# Altium schematic sheet power.SchDoc
size A4
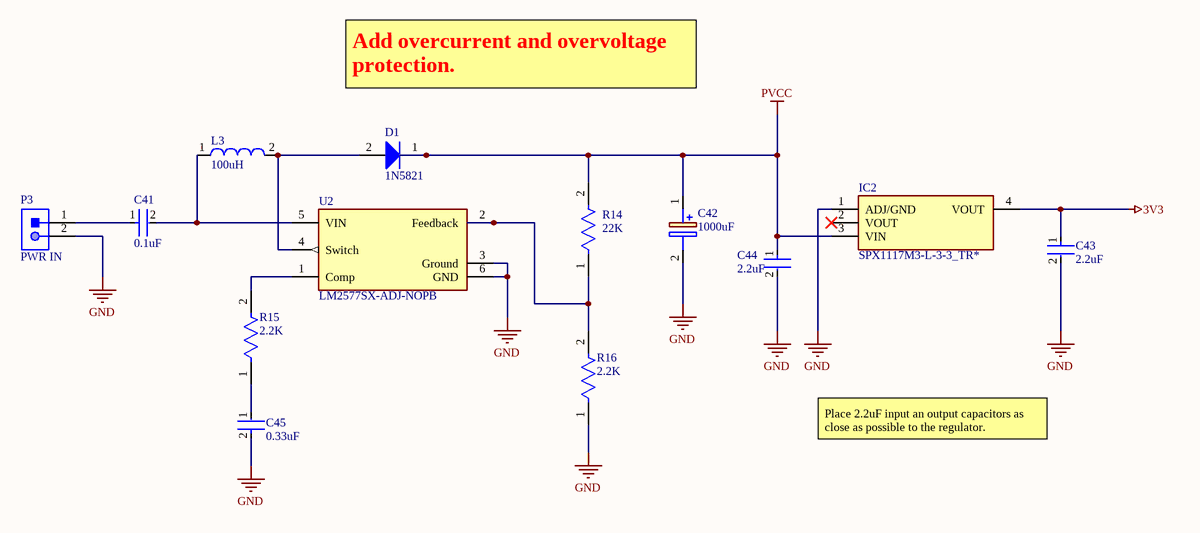
[diagram p0: power.SchDoc]

## Parts
C41  0.1uF  [TDK_C2012-125-0_2_IPC_A]
C42  1000uF  [CAPPRD500W60D1275H2700]
C43  2.2uF  [Samsung_CL21_IPC_A]
C44  2.2uF  [Samsung_CL21_IPC_A]
C45  0.33uF  [TDK_C1608-080-0_1_IPC_B]
D1  1N5821  [ONSC-AXIAL_LEAD-2-267-05_V]
IC2  SPX1117M3-L-3-3_TR*  [SOT230P700X180-4N]
L3  100uH  [WE-PD-XXL]
P3  PWR IN  [PHOE-1803277_V]
R14  22K  [TE_Connectivity_CRGCQ2512_IPC_A]
R15  2.2K  [KOA_Speer_RK73H2E_IPC_A]
R16  2.2K  [KOA_Speer_RK73H2E_IPC_A]
U2  LM2577SX-ADJ-NOPB  [Texas_Instruments_KTT0005B_MFG]

## Nets
3V3: C43.1 IC2.4(VOUT)
GND: C42.2(-) C43.2 C44.2 C45.2 IC2.1(ADJ/GND) P3.2 R16.1 U2.3(Ground) U2.6(GND)
PVCC: C42.1(+) C44.1 D1.1(K) IC2.3(VIN) R14.2
NetC41_1: C41.1 P3.1
NetC41_2: C41.2 L3.1 U2.5(VIN)
NetC45_1: C45.1 R15.1
NetD1_2: D1.2(A) L3.2 U2.4(Switch)
NetR14_1: R14.1 R16.2 U2.2(Feedback)
NetR15_2: R15.2 U2.1(Comp)

Not connected (* = marked no-connect by the designer): IC2 2(VOUT)*

## Notes on the sheet
- Add overcurrent and overvoltage protection.
- Place 2.2uF input an output capacitors as close as possible to the regulator.

## Library data of the parts
C41 = C2012X7R2A104K125AA: C Series 0805 0.1 uF 100 V ±10 % Tolerance X7R SMT Multilayer Ceramic Capacitor; Manufacturer: TDK; Capacitance: 100nF; Tolerance: 10%; Voltage Rating: 100V; Supplier 1: Digi-Key; Manufacturer Part Number: C2012X7R2A104K; RoHS: Yes; Category: Ceramic Capacitors; Stock 1: 559939; Pricing 1: 1=0.19000, 10=0.12900, 50=0.07760, 100=0.06560, 500=0.04484, 1000=0.03968 (USD); Mount: Surface Mount; Case/Package: 0805; Number of Pins: 2; Case Code (Imperial): 0805; Case Code (Metric): 2012; Min Operating Temperature: -55°C; Max Operating Temperature: 125°C; Packaging: Tape and Reel; Package Quantity: 2000; Dielectric: X7R; Termination: SMD/SMT; Construction: Flat; Length: 2mm; Depth: 1.25mm; Radiation Hardening: No; REACH SVHC: No SVHC; ComponentLink1URL: https://datasheet.ciiva.com/3777/351print-detail-pdf-phplangenpart-noc2012x7r2a104k125aaimp-unit-xmhz-3777221.pdf?src-supplier=Arrow+Electronics; ComponentLink1Description: https://datasheet.ciiva.com/3777/351print-detail-pdf-phplangenpart-noc2012x7r2a104k125aaimp-unit-xmhz-3777221.pdf?src-supplier=Arrow+Electronics; ComponentLink2URL: https://datasheet.ciiva.com/15192/getdatasheetpartid-149415-15192179.pdf?src-supplier=Verical; ComponentLink2Description: https://datasheet.ciiva.com/15192/getdatasheetpartid-149415-15192179.pdf?src-supplier=Verical; ComponentLink3URL: https://datasheet.ciiva.com/15918/517print-detail-pdf-phplangenpart-noc2012x7r2a104k125aaimp-unit-xmhz-15918629.pdf?src-supplier=Onlinecomponents.com; ComponentLink3Description: https://datasheet.ciiva.com/15918/517print-detail-pdf-phplangenpart-noc2012x7r2a104k125aaimp-unit-xmhz-15918629.pdf?src-supplier=Onlinecomponents.com; Supplier Part Number 1: 445-1418-1-ND
C42 = UVR1H102MHD1TO: CAP ALUM 1000UF 20% 50V RADIAL; Manufacturer_Name: Nichicon; Manufacturer: Kyocera AVX; Capacitance: 1mF; Life (Hours): 2000Hour; Polarity: Polar; Datasheet Link: http://nichicon-us.com/english/products/pdfs/e-uvr.pdf; Height: 27mm; Manufacturer_Part_Number: UVR1H102MHD1TO; Mouser Part Number: 647-UVR1H102MHD1T0; Mouser Price/Stock: https://www.mouser.co.uk/ProductDetail/Nichicon/UVR1H102MHD1TO?qs=Wu4QelNNmeNg4t%252BBksLOmQ%3D%3D; Arrow Part Number: UVR1H102MHD1TO; Arrow Price/Stock: https://www.arrow.com/en/products/uvr1h102mhd1to/nichicon; Supplier 1: Digi-Key; Manufacturer Part Number: UVR1H102MHD; RoHS: Yes; Stock 1: 1657; Pricing 1: 1=1.07000, 10=0.81600, 50=0.67820, 100=0.58390, 500=0.45208, 1000=0.38930, 2500=0.36418, 5000=0.34534 (USD); Mount: Through Hole,PCB; Case/Package: Radial; Min Operating Temperature: -40°C; Max Operating Temperature: 85°C; Tolerance: 20%; Voltage Rating (DC): 50V; Packaging: Bulk; Voltage Rating: 50V; Lead Pitch: 0.197inch; Height - Seated (Max): 1.063inch; ComponentLink1URL: http://nichicon-us.com/english/products/pdfs/e-mi_tape.pdf?src-supplier=Digi-Key; ComponentLink1Description: http://nichicon-us.com/english/products/pdfs/e-mi_tape.pdf?src-supplier=Digi-Key; Supplier Part Number 1: 493-1111-ND
C43 C44 = CL21B225KAFNFNE: CAP CER 2.2UF 25V X7R 0805; Manufacturer: Samsung; Tolerance: 10%; Supplier 1: Digi-Key; Manufacturer Part Number: CL21B225KAFNFNE; RoHS: Yes; Category: Ceramic Capacitors; Stock 1: 369523; Pricing 1: 1=0.22000, 10=0.15700, 50=0.08920, 100=0.07390, 500=0.05180, 1000=0.04289 (USD); Mount: Surface Mount; Case/Package: 0805; Case Code (Metric): 2012; Case Code (Imperial): 0805; Min Operating Temperature: -55°C; Max Operating Temperature: 125°C; Package Quantity: 1; Packaging: Tape and Reel; Capacitance: 2.2uF; Voltage Rating: 25V; Dielectric: X7R; Series: CL; Construction: Flat; Length: 0.079inch; Width: 0.049inch; Height: 1.25mm; Thickness: 0.053inch; Depth: 1.25mm; Radiation Hardening: No; Lead Free: Lead Free; RoHS Compliant: Yes; ComponentLink1URL: https://datasheet.ciiva.com/25798/cl21b225kafnfne-25798721.pdf?src-supplier=Digi-Key; ComponentLink1Description: https://datasheet.ciiva.com/25798/cl21b225kafnfne-25798721.pdf?src-supplier=Digi-Key; Supplier Part Number 1: 1276-2953-1-ND
C45 = C1608X7R1H334K080AC: Cap Ceramic 0.33uF 50V X7R 10% Pad SMD 0603 125°C Low ESR T/R; Manufacturer: TDK; Capacitance: 330nF; Supplier 1: Digi-Key; Manufacturer Part Number: C1608X7R1H334K080AC; RoHS: Yes; Category: Ceramic Capacitors; Stock 1: 247635; Pricing 1: 1=0.25000, 10=0.17200, 50=0.11500, 100=0.09780, 500=0.06900, 1000=0.06038 (USD); Mount: Surface Mount; Case/Package: 0603; Case Code (Metric): 1608; Case Code (Imperial): 0603; Dielectric Material: Ceramic; Weight: 7.1E-05oz; Min Operating Temperature: -55°C; Max Operating Temperature: 125°C; Tolerance: 10%; Voltage Rating: 50V; Packaging: Tape and Reel; Voltage Rating (DC): 50V; Dielectric: X7R; Termination: SMD/SMT; Construction: Flat; Package Quantity: 1; Resistor Type: Ceramic; Voltage: 50V; Series: C; Length: 1.6mm; Width: 0.031inch; Height: 0.8mm; Depth: 0.8mm; Thickness: 0.037inch; Lead Free: Lead Free; RoHS Compliant: Yes; REACH SVHC: No SVHC; ComponentLink1URL: https://datasheet.ciiva.com/6290/tdkmlcccaprange-6290782.pdf?src-supplier=Digi-Key; ComponentLink1Description: https://datasheet.ciiva.com/6290/tdkmlcccaprange-6290782.pdf?src-supplier=Digi-Key; ComponentLink2URL: https://datasheet.ciiva.com/6290/tdkmlcccaprange-6290791.pdf?src-supplier=Digi-Key; ComponentLink2Description: https://datasheet.ciiva.com/6290/tdkmlcccaprange-6290791.pdf?src-supplier=Digi-Key; ComponentLink3URL: https://datasheet.ciiva.com/22718/1796654-22718021.pdf?src-supplier=Element14; ComponentLink3Description: https://datasheet.ciiva.com/22718/1796654-22718021.pdf?src-supplier=Element14; ComponentLink4URL: https://datasheet.ciiva.com/16427/general-b11-16427753.pdf?src-supplier=Future+Electronics; ComponentLink4Description: https://datasheet.ciiva.com/16427/general-b11-16427753.pdf?src-supplier=Future+Electronics; ComponentLink5URL: https://datasheet.ciiva.com/23803/1735394-23803004.pdf?src-supplier=Newark; ComponentLink5Description: https://datasheet.ciiva.com/23803/1735394-23803004.pdf?src-supplier=Newark; ComponentLink6URL: https://datasheet.ciiva.com/28451/1796654-28451356.pdf?src-supplier=Element14; ComponentLink6Description: https://datasheet.ciiva.com/28451/1796654-28451356.pdf?src-supplier=Element14; Supplier 2: Digi-Key; Stock 2: 247635; Pricing 2: 1=0.25000, 10=0.17200, 50=0.11500, 100=0.09780, 500=0.06900, 1000=0.06038 (USD); Supplier Part Number 1: 445-5950-1-ND; Supplier Part Number 2: 445-5950-6-ND
D1 = 1N5821: Diode Schottky 30V 3A Through Hole DO-201AD; Manufacturer: On Semiconductor; Note1: 0; IFSM Max (A): 80; Packing: Bulk Bag; Configuration: Single; Max Reverse Current: 500uA; Max Surge Current: 80A; Forward Voltage: 500mV; Polarity: Standard; Capacitance: 190pF; Max Reverse Leakage Current: 2mA; ComponentLink1Description: Manufacturer URL; ComponentLink2Description: Datasheet; PartNumber: 1N5821; DatasheetVersion: Rev. 10; Mounting Technology: Through Hole; ComponentLink3URL: http://www.onsemi.com/pub_link/Collateral/267-05.PDF; ComponentLink3Description: Package Specification; ComponentLink1URL: http://www.onsemi.com/; PackageVersion: Rev. G, 06/2000; PackageDescription: 2-Pin, Axial Lead, Diameter 5.05 mm; ComponentLink2URL: http://www.onsemi.cn/pub_link/Collateral/1N5820-D.PDF; RoHS: FALSE; PackageReference: AXIAL_LEAD-2-267-05; Supplier 1: Digi-Key; Manufacturer Part Number: 1N5821; Category: Schottky Diodes; Stock 1: 982; Pricing 1: 1=0.63000, 10=0.53800, 100=0.40150, 500=0.31548 (USD); Mount: Through Hole; Case/Package: DO-201AD; Number of Pins: 2; Weight: 0.36g; Contact Plating: Tin,Matte; Min Operating Temperature: -65°C; Max Operating Temperature: 125°C; Packaging: Tape and Reel; Package Quantity: 1250; Average Rectified Current: 3A; Max Repetitive Reverse Voltage (Vrrm): 30V; Forward Current: 3A; Max Forward Surge Current (Ifsm): 80A; Peak Non-Repetitive Surge Current: 80A; Element Configuration: Single; Voltage Rating (DC): 30V; Current Rating: 3A; Output Current: 3A; Max Reverse Voltage (DC): 30V; Series: -; Diameter: 5.6mm; Length: 9.5mm; Width: 5.3mm; Height: 9.5mm; Radiation Hardening: No; RoHS Compliant: Yes; REACH SVHC: No SVHC; Lead Free: Lead Free; ComponentLink4URL: https://datasheet.ciiva.com/8302/1n5821-8302768.pdf?src-supplier=Avnet; ComponentLink4Description: https://datasheet.ciiva.com/8302/1n5821-8302768.pdf?src-supplier=Avnet; ComponentLink5URL: https://datasheet.ciiva.com/29592/1n5820-29592498.pdf?src-supplier=Digi-Key; ComponentLink5Description: https://datasheet.ciiva.com/29592/1n5820-29592498.pdf?src-supplier=Digi-Key; ComponentLink6URL: https://datasheet.ciiva.com/25951/1n5821-25951357.pdf?src-supplier=Avnet+Europe; ComponentLink6Description: https://datasheet.ciiva.com/25951/1n5821-25951357.pdf?src-supplier=Avnet+Europe; ComponentLink7URL: https://datasheet.ciiva.com/1177/107972-1177095.pdf?src-supplier=Element14; ComponentLink7Description: https://datasheet.ciiva.com/1177/107972-1177095.pdf?src-supplier=Element14; Supplier 2: Digi-Key; Stock 2: 378; Pricing 2: 1=0.63000, 10=0.53800, 100=0.40150 (USD); Supplier Part Number 1: 1990-1N5821CT-ND; Supplier Part Number 2: 1N5821FSCT-ND
IC2 = SPX1117M3-L-3-3_TR: IC REG LINEAR 3.3V 800MA SOT223 LDO; Manufacturer_Name: MaxLinear; Manufacturer_Part_Number: SPX1117M3-L-3-3/TR; Datasheet Link: https://componentsearchengine.com/Datasheets/1/SPX1117M3-L-3-3_TR.pdf; Height: 1.8mm; Mouser Part Number: 701-SPX1117M3-L-33TR; Mouser Price/Stock: https://www.mouser.co.uk/ProductDetail/MaxLinear/SPX1117M3-L-3-3-TR?qs=S%2FCBhQS5rCofor8XCFP4ag%3D%3D; Arrow Part Number: SPX1117M3-L-3-3/TR; Arrow Price/Stock: https://www.arrow.com/en/products/spx1117m3-l-3-3tr/maxlinear-inc; Supplier 1: Digi-Key; Supplier Part Number 1: 1016-1848-1-ND
L3 = 7447709101: WURTH ELEKTRONIK - 7447709101 - Power Inductor (SMD), 100 µH, 2.5 A, Shielded, 3.1 A, WE-PD Series, 12mm x 12mm x 10mm; Manufacturer: Wurth Electronics; Inductance: 100 ÂµH; Core Material: Ferrite; Tolerance: 20%; Self Resonant Frequency: 6MHz; Current Rating: 2.5A; Saturation Current: 3.1A; Resistance: 110mR; Test Frequency: 1kHz; Impedance: 100mR; ComponentLink1Description: Manufacturer Link; ComponentLink2Description: Datasheet; DatasheetVersion: ver 1, Oct-2004; ComponentLink1URL: http://www.we-online.com; PackageVersion: 2004; PackageDescription: SMD Inductor, 2-Leads, Body 12.0 x 12.0 mm; ComponentLink2URL: http://www.we-online.de/katalog/media/pdf/7447709101.pdf; PackageReference: WE-PD-XXL; PartNumber: 7447709101; Supplier 1: Digi-Key; Manufacturer Part Number: 7447709101; RoHS: Yes; Category: Fixed Inductors; Stock 1: 22437; Pricing 1: 1=2.41000, 10=2.20000, 50=2.07000, 100=1.94000 (USD); Mount: Surface Mount; Case/Package: Nonstandard; Number of Pins: 2; Weight: 0.01lb; Case Code (Metric): 3225; Case Code (Imperial): 1210; Min Operating Temperature: -40°C; Max Operating Temperature: 125°C; Inductance Tolerance: 20%; Packaging: Tape and Reel; Shielding: Shielded; Package Quantity: 250; Max DC Current: 2.5A; DC Resistance (DCR): 110mR; Termination: SMD/SMT; Resistor Type: Wirewound; DC Current: 2.5A; RMS Current (Irms): 2.5A; Series Resistance: 110mR; Series: WE-PD; Inductor Type: POWER; Length: 12mm; Width: 12mm; Height: 10mm; Height - Seated (Max): 0.394inch; Depth: 12.5mm; Size: 10mm; REACH SVHC: Unknown; Military Standard: Not; RoHS Compliant: Yes; Lead Free: Lead Free; ComponentLink3URL: https://datasheet.ciiva.com/4954/7447709101-44073-4954756.pdf?src-supplier=Mouser; ComponentLink3Description: https://datasheet.ciiva.com/4954/7447709101-44073-4954756.pdf?src-supplier=Mouser; ComponentLink4URL: https://datasheet.ciiva.com/22709/1736294-22709761.pdf?src-supplier=Element14; ComponentLink4Description: https://datasheet.ciiva.com/22709/1736294-22709761.pdf?src-supplier=Element14; ComponentLink5URL: https://datasheet.ciiva.com/11800/0900766b8079f802-11800213.pdf?src-supplier=RSComponents; ComponentLink5Description: https://datasheet.ciiva.com/11800/0900766b8079f802-11800213.pdf?src-supplier=RSComponents; ComponentLink6URL: https://datasheet.ciiva.com/6983/7447709101-6983170.pdf?src-supplier=Newark; ComponentLink6Description: https://datasheet.ciiva.com/6983/7447709101-6983170.pdf?src-supplier=Newark; ComponentLink7URL: https://datasheet.ciiva.com/1052/7447709101-1052454.pdf?src-supplier=Digi-Key; ComponentLink7Description: https://datasheet.ciiva.com/1052/7447709101-1052454.pdf?src-supplier=Digi-Key; ComponentLink8URL: https://datasheet.ciiva.com/7754/1736294-7754651.pdf?src-supplier=Element14; ComponentLink8Description: https://datasheet.ciiva.com/7754/1736294-7754651.pdf?src-supplier=Element14; Supplier Part Number 1: 732-1248-1-ND
P3 = 1803277: Conn;  TermBlk;  PCB;  Header;  SnglLvl;  90DegAngl;  Sldr;  2Pole;  3.81mmPitch;  COMBICON; Manufacturer: Phoenix Contact; Tolerance: 5%; Elements: 4; Voltage Rating: 50 V; Case\Package: 1205; Resistance: 10 kohm; Power Rating: 248 mW; Max Current Rating: 8A; Number of Contacts: 2; Gender: Male; Number of Levels: 1; Voltage: 300V; Connector Type: Plug,PCB,Terminal Block; Voltage Rating (DC): 640mV; Voltage Rating (AC): 160V; Pitch: 3.81mm; Approvals: UL,CSA; RoHSCompliant: true; Min Operating Temperature: -55 degC; Case Code (Imperial): 1206; Width: 0.063 inch; Pins: 8; ComponentLink1Description: Manufacturer URL; ComponentLink2Description: Datasheet; DatasheetVersion: Feb-14; ComponentLink3URL: https://www.phoenixcontact.com/online/portal/us/pxc/product_detail_page/!ut/p/b1/3ZfJkqM4EIafpR6AQmA2H9n3fTNcCLbCgDGrDfjpp6pmYg4T012XDh-MLkihiC__TGUqBcdwBKEIwNDDAScAfILja3qvq3Sp-2t6-ZrHROIxHs9bKIGYNs4AmcNZXsMcRDJQOIRPAEvchpoUjx1UTZ38Zl8Xbz54zDr6CpsNzjayIR3; ComponentLink1URL: http://www.phoenixcontact.com/; ComponentLink2URL: https://datasheet.ciiva.com/16096/1803277-16096845.pdf; PackageReference: 1803277; ComponentLink3Description: Package Specification; Mount: Surface Mount; Length: 0.126 inch; REACH SVHC: No SVHC; Radiation Hardening: No; Max Operating Temperature: 125 degC; Package Quantity: 1; Height: 0.024 inch; Packaging: Cut Tape; PackageDescription: Male Header, Pitch 3.81 mm, 1 x 2 Position, Height 7.25 mm, Tail Length 3.4 mm; Case Code (Metric): 3216; PartNumber: 1803277; Supplier 1: Digi-Key; Supplier 2: Newark; Supplier 3: Allied Electronics; Supplier 4: Mouser; Supplier 5: Arrow Electronics; Supplier Part Number 1: 277-1206-ND; Supplier Part Number 2: 80R8083; Supplier Part Number 3: 70054540; Supplier Part Number 4: 651-1803277; Supplier Part Number 5: 1803277; Manufacturer Part Number: 1803277; RoHS: Yes; Category: Terminal Blocks; Stock 1: 15554; Pricing 1: 1=0.83000, 10=0.79400, 50=0.75900, 100=0.73830, 250=0.69000, 500=0.63480, 1000=0.58650, 2500=0.55890, 5000=0.52440 (USD); Contact Plating: Tin; Housing Color: Green; Housing Material: Polybutylene; Contact Material: Tin; Color: Green; Weight: 4oz; Number of Rows: 1; Termination: Solder; Orientation: Right Angle; Number of Poles: 2; Current Rating: 8A; Number of Positions Per Level: 2; Current: 8A; Number of Positions: 2; Series: MC; Contact Gender: Male; Depth: 9.2mm; Lead Free: Lead Free; RoHS Compliant: Yes; Flammability Rating: UL94 V-0; ComponentLink4URL: https://datasheet.ciiva.com/795/1803277-795413.pdf?src-supplier=Digi-Key; ComponentLink4Description: https://datasheet.ciiva.com/795/1803277-795413.pdf?src-supplier=Digi-Key; ComponentLink5URL: https://datasheet.ciiva.com/11746/0900766b80029ea6-11746612.pdf?src-supplier=RSComponents; ComponentLink5Description: https://datasheet.ciiva.com/11746/0900766b80029ea6-11746612.pdf?src-supplier=RSComponents; ComponentLink6URL: https://datasheet.ciiva.com/16096/1803277-16096845.pdf?src-supplier=Onlinecomponents.com; ComponentLink6Description: https://datasheet.ciiva.com/16096/1803277-16096845.pdf?src-supplier=Onlinecomponents.com; ComponentLink7URL: https://datasheet.ciiva.com/23596/1581611-23596276.pdf?src-supplier=Newark; ComponentLink7Description: https://datasheet.ciiva.com/23596/1581611-23596276.pdf?src-supplier=Newark; ComponentLink8URL: https://datasheet.ciiva.com/26840/getdatasheetpartid-233794-26840495.pdf?src-supplier=Verical; ComponentLink8Description: https://datasheet.ciiva.com/26840/getdatasheetpartid-233794-26840495.pdf?src-supplier=Verical; ComponentLink9URL: https://datasheet.ciiva.com/29212/740533-da-01-de-leiterplattenstecker-mc-1-5-2-g-3-81-29212066.pdf?src-supplier=Conrad; ComponentLink9Description: https://datasheet.ciiva.com/29212/740533-da-01-de-leiterplattenstecker-mc-1-5-2-g-3-81-29212066.pdf?src-supplier=Conrad
R14 = CRGCQ2512F22K: 22 kOhms ±1% 1W Chip Resistor 2512 (6432 Metric) Automotive AEC-Q200, Moisture Resistant Thick Film; Manufacturer: TE Connectivity; Supplier 1: Digi-Key; RoHS: Yes; Stock 1: 33852; Pricing 1: 1=0.46000, 10=0.35000, 100=0.14710, 1000=0.08118 (USD); RoHS Compliant: Yes; Supplier Part Number 1: A130009CT-ND; Manufacturer Part Number: CRGCQ2512F22K
R15 R16 = RK73H2ETTD2201F: Thick Film Resistors 1/2watts 2.2Kohms 1%; Manufacturer: KOA Speer; Resistance: 2.2kR; Power Rating: 500mW; Voltage Rating: 200V; Temperature Coefficient: 100ppm/°C; Supplier 1: Digi-Key; Manufacturer Part Number: RK73H2ETTD2201F; RoHS: Yes; Category: Chip SMD Resistors; Stock 1: 11900; Pricing 1: 1=0.21000, 10=0.17700, 100=0.06920, 1000=0.02898, 2500=0.02656 (USD); Case/Package: 1210; Case Code (Imperial): 1210; Case Code (Metric): 3225; Min Operating Temperature: -55°C; Max Operating Temperature: 155°C; Tolerance: 1%; Packaging: Tape and Reel; Package Quantity: 5000; Resistor Type: Thick Film; Termination: SMD/SMT; Series: RK73H; Construction: Rectangular; Length: 3.2mm; Width: 2.6mm; Height: 0.6mm; Depth: 2.6mm; Military Standard: Not; Lead Free: Lead Free; RoHS Compliant: Yes; ComponentLink1URL: https://datasheet.ciiva.com/5592/rk73h-5592280.pdf?src-supplier=Mouser; ComponentLink1Description: https://datasheet.ciiva.com/5592/rk73h-5592280.pdf?src-supplier=Mouser; Supplier 2: Digi-Key; Stock 2: 11900; Pricing 2: 1=0.21000, 10=0.17700, 100=0.06920, 1000=0.02898, 2500=0.02656 (USD); Supplier 3: RSComponents; Stock 3: 1; Pricing 3: 50=0.18500, 100=0.16000, 250=0.11200, 500=0.08600, 1250=0.08400 (USD); Supplier Part Number 1: 2019-RK73H2ETTD2201FCT-ND; Supplier Part Number 2: 2019-RK73H2ETTD2201FDKR-ND; Supplier Part Number 3: 1234408
U2 = LM2577SX-ADJ-NOPB: Conv DC-DC 3.5V to 40V Step Up Single-Out 11.6V to 12.4V 3A 6-Pin(5+Tab) TO-263 T/R; Manufacturer: TI National Semiconductor; Manufacturer Part Number: LM2577SX-ADJ/NOPB; Efficiency: 80%; Number of Outputs: 1; Switching Frequency: 56kHz; Min Output Voltage: 1.23V; Max Output Voltage: 15V; Synchronous Rectifier: No; Quiescent Current: 10mA; Topology: Boost,Flyback,Forward Converter; Output Type: Adjustable; Supplier 1: Digi-Key; RoHS: Yes; Category: Voltage Regulators - Switching; Stock 1: 2473; Pricing 1: 1=7.97000, 10=7.20400, 25=6.86880, 100=5.96420, 250=5.69612 (USD); Mount: Surface Mount; Case/Package: TO-263; Number of Pins: 5; Contact Plating: Tin,Matte; Min Operating Temperature: -40°C; Max Operating Temperature: 125°C; Packaging: Tape and Reel; Min Input Voltage: 3.5V; Output Current: 3A; Output Voltage: 12.4V; Max Output Current: 3A; Max Input Voltage: 40V; Package Quantity: 500; Min Supply Voltage: 3.5V; Operating Supply Voltage: 40V; Series: SIMPLE SWITCHER®; Radiation Hardening: No; Lead Free: Contains Lead; RoHS Compliant: Yes; ComponentLink1URL: https://datasheet.ciiva.com/15113/getdatasheetpartid-139819-15113073.pdf?src-supplier=Verical; ComponentLink1Description: https://datasheet.ciiva.com/15113/getdatasheetpartid-139819-15113073.pdf?src-supplier=Verical; ComponentLink2URL: https://datasheet.ciiva.com/41457/001013751-da-01-en-ic-reg-mu-lm2577sx-adj-nopb-to-263-5-tid-41457623.pdf?src-supplier=Conrad; ComponentLink2Description: https://datasheet.ciiva.com/41457/001013751-da-01-en-ic-reg-mu-lm2577sx-adj-nopb-to-263-5-tid-41457623.pdf?src-supplier=Conrad; ComponentLink3URL: https://datasheet.ciiva.com/6603/lm1577-6603353.pdf?src-supplier=Digi-Key; ComponentLink3Description: https://datasheet.ciiva.com/6603/lm1577-6603353.pdf?src-supplier=Digi-Key; ComponentLink4URL: https://datasheet.ciiva.com/6603/lm1577-6603355.pdf?src-supplier=Digi-Key; ComponentLink4Description: https://datasheet.ciiva.com/6603/lm1577-6603355.pdf?src-supplier=Digi-Key; Supplier 2: Digi-Key; Stock 2: 2473; Pricing 2: 1=7.97000, 10=7.20400, 25=6.86880, 100=5.96420, 250=5.69612 (USD); Supplier Part Number 1: LM2577SX-ADJ/NOPBCT-ND; Supplier Part Number 2: LM2577SX-ADJ/NOPBDKR-ND